# Altium schematic sheet v1.0.SchDoc
size 228 x 83 mm; PageSetup: Record=PageOptions|CenterHorizontal=True|CenterVertical=True|PrintScale=1.28|XCorrection=1.00|YCorrection=1.00|PrintKind=0|BorderSize=5000000|LeftOffset=0|BottomOffset=0|Orientation=2|PaperLength=1000|PaperWidth=1000|Scale=100|PaperSource=7|PrintQuality=-3|MediaType=1|DitherType=10|PrintScaleMode=1|PaperKind=A4|PaperIndex=9
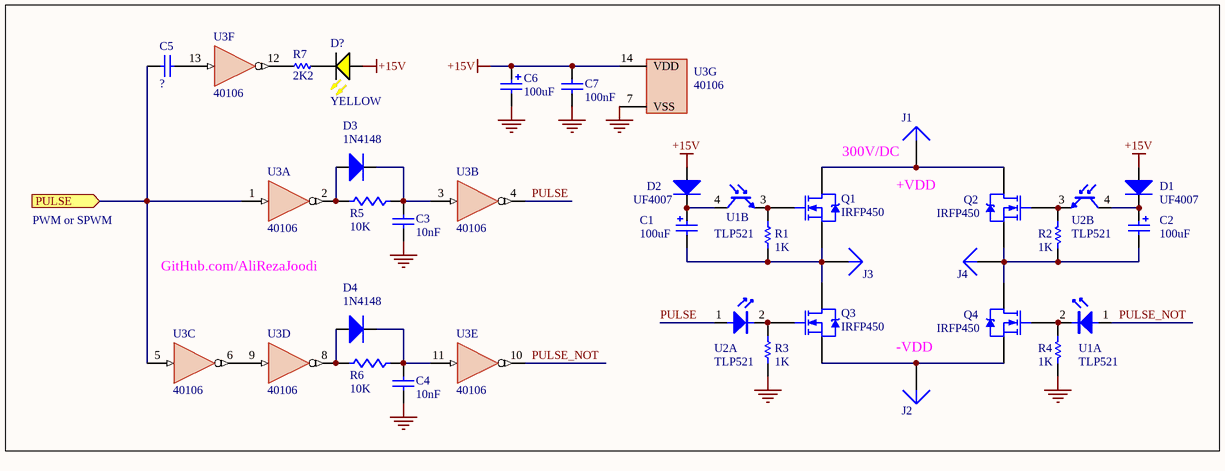
[diagram p0: v1.0.SchDoc]

## Parts
C1  value 100uF  [CAPPR2.5-6.3x5]  (hidden comment: Cap Pol1)
C2  value 100uF  [CAPPR2.5-6.3x5]  (hidden comment: Cap Pol1)
C3  value 10nF  [CAPNTO2.54-3.05x1.78A]  (hidden comment: Cap)
C4  value 10nF  [CAPNTO2.54-3.05x1.78A]  (hidden comment: Cap)
C5  ?  [CAPNTO2.54-3.05x1.78A]
C6  value 100uF  [CAPPR2.5-6.3x5]  (hidden comment: Cap Pol1)
C7  value 100nF  [CAPNTO2.54-3.05x1.78A]  (hidden comment: Cap)
D1  UF4007  [DIODE-0.4]
D2  UF4007  [DIODE-0.4]
D3  1N4148  [DIODE0.4_Glass]
D4  1N4148  [DIODE0.4_Glass]
D?  YELLOW  [LED_THD_5MM_YELLOW]
J1  COAX-M  [PIN1]  (value not drawn)
J2  COAX-M  [PIN1]  (value not drawn)
J3  COAX-M  [PIN1]  (value not drawn)
J4  COAX-M  [PIN1]  (value not drawn)
Q1  IRFP450  [TO247AC]
Q2  IRFP450  [TO247AC]
Q3  IRFP450  [TO247AC]
Q4  IRFP450  [TO247AC]
R1  value 1K  [AXIAL-0.4]  (hidden comment: RES)
R2  value 1K  [AXIAL-0.4]  (hidden comment: RES)
R3  value 1K  [AXIAL-0.4]  (hidden comment: RES)
R4  value 1K  [AXIAL-0.4]  (hidden comment: RES)
R5  value 10K  [AXIAL0.4]  (hidden comment: Res1)
R6  value 10K  [AXIAL-0.4]  (hidden comment: Res1)
R7  2K2  [R_THD_AXIAL0.4(1/4W)]
U1  TLP521  [DIP-4]  (parts A,B of 2)
U2  TLP521  [DIP-4]  (parts A,B of 2)
U3  40106  [DIP_14]  (parts A,B,C,D,E,F,G of 7)

## Ports
PULSE (in)

## Nets
+15V: C6.1 C7.1 D1.1(A) D2.1(A) D?.1(A) U3.14(VDD)
GND: C3.2 C4.2 C6.2 C7.2 R3.2 R4.2 U3.7(VSS)
PULSE: U2.1(A) U3.4(~{O})
PULSE: C5.1 U3.1(I) U3.5(I) ; port PULSE  [a separate net that carries the same name]
PULSE_NOT: U1.1(A) U3.10(~{O})
NetC1_1: C1.1 D2.2(K) U1.4(C)
NetC1_2: C1.2 J3.1(A) Q1.3(S) Q3.2(D) R1.1
NetC2_1: C2.1 D1.2(K) U2.4(C)
NetC2_2: C2.2 J4.1(A) Q2.3(S) Q4.2(D) R2.1
NetC3_1: C3.1 D3.2(K) R5.2 U3.3(I)
NetC4_1: C4.1 D4.2(K) R6.2 U3.11(I)
NetC5_2: C5.2 U3.13(I)
NetD3_1: D3.1(A) R5.1 U3.2(~{O})
NetD4_1: D4.1(A) R6.1 U3.8(~{O})
NetD?_2: D?.2(K) R7.2
NetJ1_1: J1.1(A) Q1.2(D) Q2.2(D)
NetJ2_1: J2.1(A) Q3.3(S) Q4.3(S)
NetQ1_1: Q1.1(G) R1.2 U1.3(E)
NetQ2_1: Q2.1(G) R2.2 U2.3(E)
NetQ3_1: Q3.1(G) R3.1 U2.2(K)
NetQ4_1: Q4.1(G) R4.1 U1.2(K)
NetR7_1: R7.1 U3.12(~{O})
NetU3_6: U3.6(~{O}) U3.9(I)

## Notes on the sheet
- 300V/DC
- (near J1) +VDD
- PWM or SPWM
- GitHub.com/AliRezaJoodi
- (near J2) -VDD

## Library data of the parts
C1 C2 C6 = Cap Pol1: Polarized Capacitor (Radial); Manufacturer: Generic Components; Class I: Passive; Published: 8-Jun-2000; Revision: July-2002: Re-released for DXP Platform.; Publisher: Altium Limited; Class II: Capacitor
C3 C4 C7 = Cap: Capacitor; Manufacturer: Generic Components; Class I: Passive; Published: 8-Jun-2000; Revision: July-2002: Re-released for DXP Platform.; Publisher: Altium Limited; Class II: Capacitor
C5 = Cap: Capacitor; Manufacturer: Generic Components; Class I: Passive; Value: 10nF; Published: 8-Jun-2000; Revision: July-2002: Re-released for DXP Platform.; Publisher: Altium Limited; Class II: Capacitor
D1-D4 = Diode: Default Diode; Manufacturer: Generic Components; Class I: Discrete; Class II: Diode - Switching; Published: 8-Jun-2000; Revision: July-2002: Re-released for DXP Platform.; Publisher: Altium Limited
  D3 D4: Value: 1N4148
D? = LED_YELLOW: LED, Yellow; Manufacturer: Generic Components; Class I: Optoelectronic; Published: 8-Jun-2000; Revision: July-2002: Re-released for DXP Platform.; Publisher: Altium Limited; Class II: LED
J1-J4 = COAX-M: Coax-M Connector; Manufacturer: Generic Components; Revision: July-2002: Re-released for DXP Platform.; Publisher: Altium Limited; Class I: Connector
Q1-Q4 = NMOS-2: N-Channel Power MOSFET; Manufacturer: Generic Components; Class I: Discrete; Class II: MOSFET - Power; Note: Pin 2 is electrically connected to pin 4.; Published: 8-Jun-2000; Revision: July-2002: Re-released for DXP Platform.; Datasheet: Latest Revision: PD-9.814; Package Reference: TO-220AB; Publisher: Altium Limited
R1-R6 = Res1: Resistor; Manufacturer: Generic Components; Class I: Passive; Published: 8-Jun-2000; Revision: July-2002: Re-released for DXP Platform.; Publisher: Altium Limited; Class II: Resistor
R7 = Resistor: Revision: July-2002: Re-released for DXP Platform.
U1 U2 = Optoisolator: Publisher: Altium Limited; Value: TLP521
U3 = 40106: Hex inverting Schmitt trigger, 14-Pin; Publisher: Altium Limited; ComponentLink1URL: http://www.nxp.com